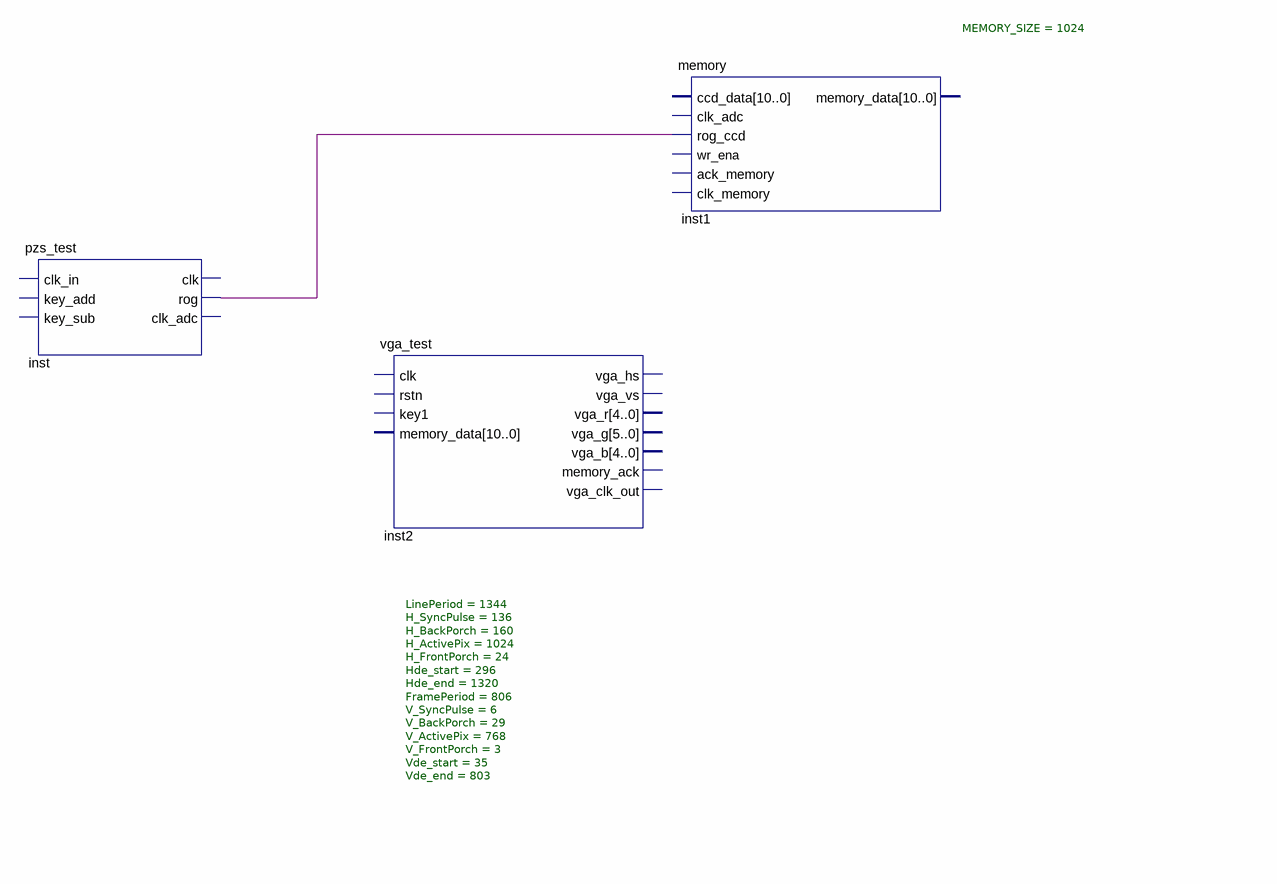
[diagram p0: schematic sheet]
// Quartus schematic monochr_sch.bdf as structural Verilog: 3 symbols, 0 pins
module monochr_sch (
);

  wire inst_rog;

  pzs_test inst (.rog(inst_rog));  // open: clk_in, key_add, key_sub, clk, clk_adc
  vga_test #(.LinePeriod(1344), .H_SyncPulse(136), .H_BackPorch(160), .H_ActivePix(1024), .H_FrontPorch(24), .Hde_start(296), .Hde_end(1320), .FramePeriod(806), .V_SyncPulse(6), .V_BackPorch(29), .V_ActivePix(768), .V_FrontPorch(3), .Vde_start(35), .Vde_end(803)) inst2 ();  // open: clk, rstn, key1, memory_data, vga_hs, vga_vs, vga_r, vga_g, vga_b, memory_ack, vga_clk_out
  memory #(.MEMORY_SIZE(1024)) inst1 (.rog_ccd(inst_rog));  // open: ccd_data, clk_adc, wr_ena, ack_memory, clk_memory, memory_data
endmodule
